# EasyEDA Pro project DRV8701-sch-pcb.epro

# Schematic Schematic1
Board Name: Board1; Create Date: 2025-10-30; Page Name: P1; Project Name: DRV8701-10-30; Schematic Name: Schematic1; Update Date: 2025-11-10; Company: 嘉立创EDA; Page Size: A4; Version: V1.0
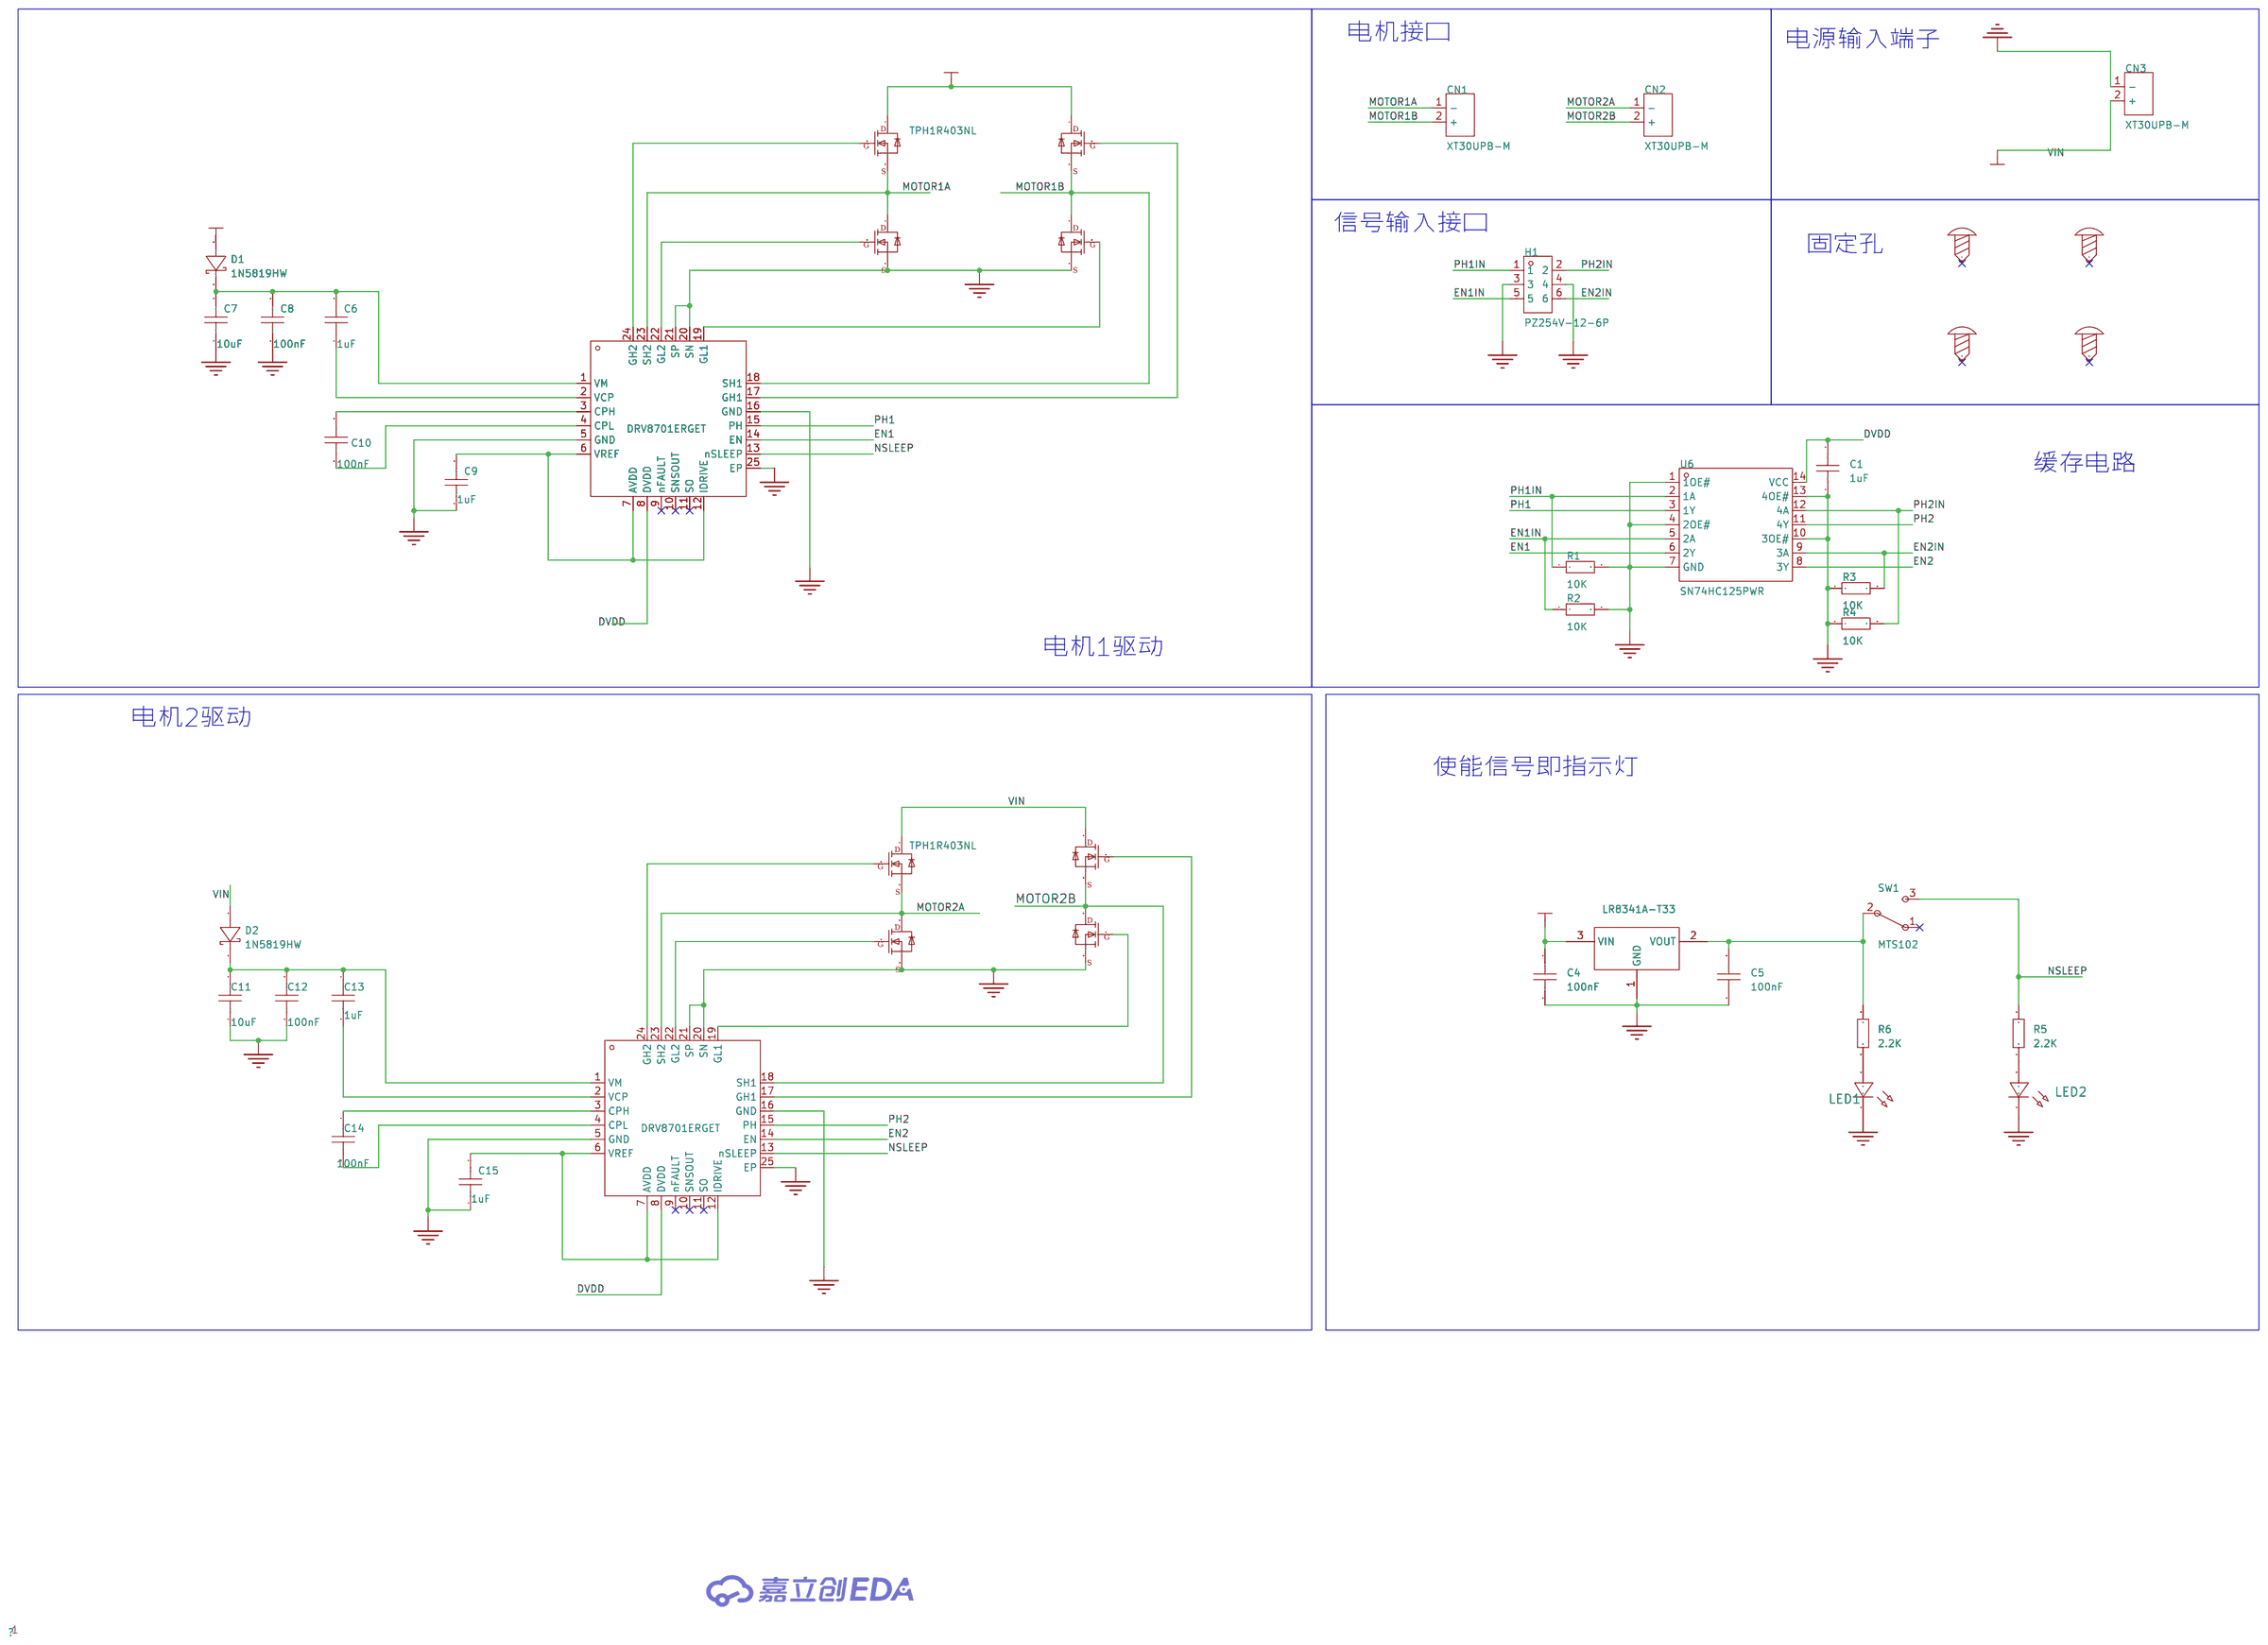
[diagram p0: schematic sheet]

## Parts
C1  1uF  [C0603]
C4  100nF  [C0603]
C5  100nF  [C0603]
C6  1uF  [C0603]
C7  10uF  [C0603]
C8  100nF  [C0603]
C9  1uF  [C0603]
C10  100nF  [C0603]
C11  10uF  [C0603]
C12  100nF  [C0603]
C13  1uF  [C0603]
C14  100nF  [C0603]
C15  1uF  [C0603]
CN1  XT30UPB-M  [CONN-TH_XT30UPB-M]
CN2  XT30UPB-M  [CONN-TH_XT30UPB-M]
CN3  XT30UPB-M  [CONN-TH_XT30UPB-M]
D1  1N5819HW  [SOD-123_L2.7-W1.6-LS3.7-RD-1]
D2  1N5819HW  [SOD-123_L2.7-W1.6-LS3.7-RD-1]
H1  PZ254V-12-6P  [HDR-TH_6P-P2.54-V-M-R2-C3-S2.54]
LED1  -  [LED_0603]
LED2  -  [LED_0603]
Q1  TPH1R403NL  [DFN5x6]
Q3  TPH1R403NL  [DFN5x6]
Q6  TPH1R403NL  [DFN5x6]
Q7  TPH1R403NL  [DFN5x6]
Q12  TPH1R403NL  [DFN5x6]
Q13  TPH1R403NL  [DFN5x6]
Q15  TPH1R403NL  [DFN5x6]
Q16  TPH1R403NL  [DFN5x6]
R1  10K  [R0603]
R2  10K  [R0603]
R3  10K  [R0603]
R4  10K  [R0603]
R5  2.2K  [R0603]
R6  2.2K  [R0603]
SCREW1  -  [M3螺丝]
SCREW2  -  [M3螺丝]
SCREW3  -  [M3螺丝]
SCREW4  -  [M3螺丝]
SW1  MTS102  [MTS102]
U2  DRV8701ERGET  [VQFN-24_L4.0-W4.0-P0.50-BL-EP2.5]
U3  DRV8701ERGET  [VQFN-24_L4.0-W4.0-P0.50-BL-EP2.5]
U6  SN74HC125PWR  [TSSOP-14_L5.0-W4.4-P0.65-LS6.5-BL]
U8  LR8341A-T33  [SOT-23]

## Library data of the parts
C1 C4-C15 = CAP_0603: Supplier Footprint: 0603
CN1-CN3 = XT30UPB-M: Supplier: LCSC; Supplier Part: C428721; Manufacturer: Changzhou Amass Elec; Paste Type: expand
D1 D2 = 1N5819HW: 二极管配置:-;正向压降(Vf):900mV@3A;直流反向耐压(Vr):40V;整流电流:1A;; LCSC Part Name: 电压:40V 电流:1A; Supplier Part: C2905649; Manufacturer: TECH PUBLIC(台舟); Supplier Footprint: SOD-123; JLCPCB Part Class: 扩展库; Datasheet: https://item.szlcsc.com/datasheet/1N5819HW/3175946.html; Supplier: LCSC; Voltage - Forward(Vf@If): 900mV@3A; Voltage - DC Reverse(Vr): 40V; Current - Rectified: 1A; Reverse Leakage Current (Ir): 1mA@40V; Non-Repetitive Peak Forward Surge Current: 9A
H1 = PZ254V-12-6P: 插针结构:2x3P;间距:2.54mm;行距:2.54mm;圆针/方针:方针;安装类型:直插;排数:双排;总PIN位数:6P;额定电流:-;额定电压:-;配合针长度:6mm;塑高:2.5mm;端接针长度:3mm;触头材质:黄铜;触头镀层:-;工作温度范围:-40℃~+105℃;颜色:黑色;; LCSC Part Name: 间距:2.54mm 2x3P 直插 方针; Supplier Part: C492420; Manufacturer: XFCN(兴飞); Supplier Footprint: 插件,P=2.54mm; JLCPCB Part Class: 扩展库; Datasheet: https://atta.szlcsc.com/upload/public/pdf/source/20200309/C492420_BAECB307B001054C09D200388220EAE6.pdf; Supplier: LCSC; Pin Structure: 2x3P; Pitch: 2.54mm; Row Spacing: 2.54mm; Circluar Pins/Square Pins: 方针; Mounting Type: 直插; Number of Rows: 双排; Number of Pins: 6P; Length of Mating Pin: 6mm; Insulation Height: 2.5mm; Length of End Connection Pin: 3mm; Contact Material: 黄铜; Operating Temperature Range: -40℃~+105℃; Color: 黑色
LED1 LED2 = LED_0603-R: Supplier Footprint: 0603
Q1 Q3 Q6 Q7 Q12 Q13 Q15 Q16 = TPH1R403NL
R1-R6 = Res_0603: Supplier Footprint: 0603
SCREW1-SCREW4 = M3螺丝: Supplier Footprint: 插件
SW1 = MTS102: _: 3
U2 U3 = DRV8701ERGET: DRV8701 47V H 桥智能栅极驱动器; LCSC Part Name: 有刷直流电机驱动芯片 5.5V; Supplier Part: C132049; Manufacturer: TI(德州仪器); Supplier Footprint: VQFN-24(4x4); JLCPCB Part Class: 扩展库; Datasheet: https://www.ti.com/cn/lit/gpn/drv8701; Supplier: LCSC
U6 = SN74HC125PWR: 输入类型:-;工作电压:2V~6V;元件数:4;每个元件位数:1;灌电流(IOL):7.8mA;拉电流(IOH):7.8mA;; LCSC Part Name: 三态输出，四路总线缓冲门; Supplier Part: C132994; Manufacturer: TI(德州仪器); Supplier Footprint: TSSOP-14; JLCPCB Part Class: 扩展库; Datasheet: https://www.ti.com/cn/lit/gpn/sn74hc125; Supplier: LCSC; output type: 三态; Voltage - Supply: 2V~6V; Number of Elements: 4; Number of Bits per Element: 1; Current - Output Low(IOL): 7.8mA; Current - Output High(IOH): 7.8mA; Logic Family: 74HC; Operating Temperature: -40℃~+85℃
U8 = LR8341A-T33: Revision: V1.0

## Nets
DVDD: C1.2 U2.8(DVDD) U3.8(DVDD) U6.14(VCC)
GND: C1.1 C4.1 C5.1 C7.1 C8.1 C9.1 C11.1 C12.1 C15.1 CN3.1(-) H1.3 H1.4 LED1.1(C) LED2.1(C) Q3.3(S) Q7.3(S) Q12.3(S) Q16.3(S) R1.2 R2.2 R3.1 R4.1 U2.5(GND) U2.16(GND) U2.20(SN) U2.21(SP) U2.25(EP) U3.5(GND) U3.16(GND) U3.20(SN) U3.21(SP) U3.25(EP) U6.1(1OE#) U6.4(2OE#) U6.7(GND) U6.10(3OE#) U6.13(4OE#) U8.1(GND)
VIN: C4.2 CN3.2(+) D1.2(A) D2.2(A) Q1.1(D) Q6.1(D) Q13.1(D) Q15.1(D) U8.3(VIN)
EN1: U2.14(EN) U6.6(2Y)
EN1IN: H1.5 R2.1 U6.5(2A)
EN2: U3.14(EN) U6.8(3Y)
EN2IN: H1.6 R3.2 U6.9(3A)
MOTOR1A: CN1.1(-) Q1.3(S) Q3.1(D) U2.23(SH2)
MOTOR1B: CN1.2(+) Q12.1(D) Q13.3(S) U2.18(SH1)
MOTOR2A: CN2.1(-) Q6.3(S) Q7.1(D) U3.23(SH2)
MOTOR2B: CN2.2(+) Q15.3(S) Q16.1(D) U3.18(SH1)
NSLEEP: R5.2 SW1.3(ON) U2.13(nSLEEP) U3.13(nSLEEP)
PH1: U2.15(PH) U6.3(1Y)
PH1IN: H1.1 R1.1 U6.2(1A)
PH2: U3.15(PH) U6.11(4Y)
PH2IN: H1.2 R4.2 U6.12(4A)
$1N1170: C9.2 U2.6(VREF) U2.7(AVDD) U2.12(IDRIVE)
$1N1184: C10.2 U2.3(CPH)
$1N1190: C10.1 U2.4(CPL)
$1N1364: C6.2 C7.2 C8.2 D1.1(K) U2.1(VM)
$1N1383: C6.1 U2.2(VCP)
$1N2084: Q1.2(G) U2.24(GH2)
$1N2125: Q12.2(G) U2.19(GL1)
$1N2170: Q3.2(G) U2.22(GL2)
$1N2669: C15.2 U3.6(VREF) U3.7(AVDD) U3.12(IDRIVE)
$1N2677: C14.1 U3.3(CPH)
$1N2681: C14.2 U3.4(CPL)
$1N2741: Q6.2(G) U3.24(GH2)
$1N2748: Q16.2(G) U3.19(GL1)
$1N2751: Q7.2(G) U3.22(GL2)
$1N4000: C5.2 R6.2 SW1.2(OFF) U8.2(VOUT)
$1N4233: LED1.2(A) R6.1
$1N4235: LED2.2(A) R5.1
$1N8347: Q15.2(G) U3.17(GH1)
$1N8399: Q13.2(G) U2.17(GH1)
$1N8457: C13.2 U3.2(VCP)
$1N8464: C11.2 C12.2 C13.1 D2.1(K) U3.1(VM)

Not connected (* = marked no-connect by the designer): SCREW1 1*; SCREW2 1*; SCREW3 1*; SCREW4 1*; SW1 1(ON)*; U2 9(nFAULT)* 10(SNSOUT)* 11(SO)*; U3 9(nFAULT)* 10(SNSOUT)* 11(SO)*

## Notes on the sheet
- 电机接口
- 电源输入端子
- 信号输入接口
- 固定孔
- 缓存电路
- 电机1驱动
- 电机2驱动
- 使能信号即指示灯

# Board PCB1
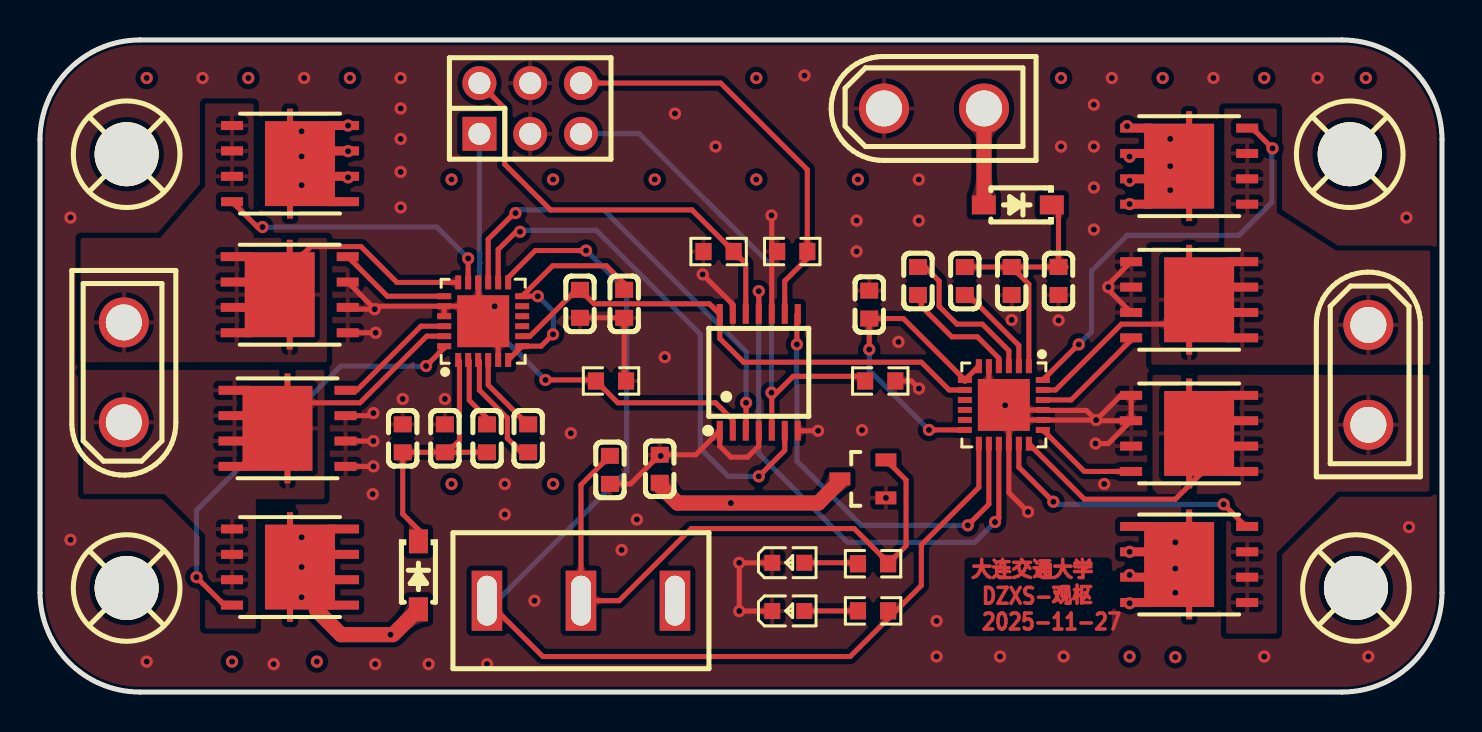
[diagram p1: board, top side]
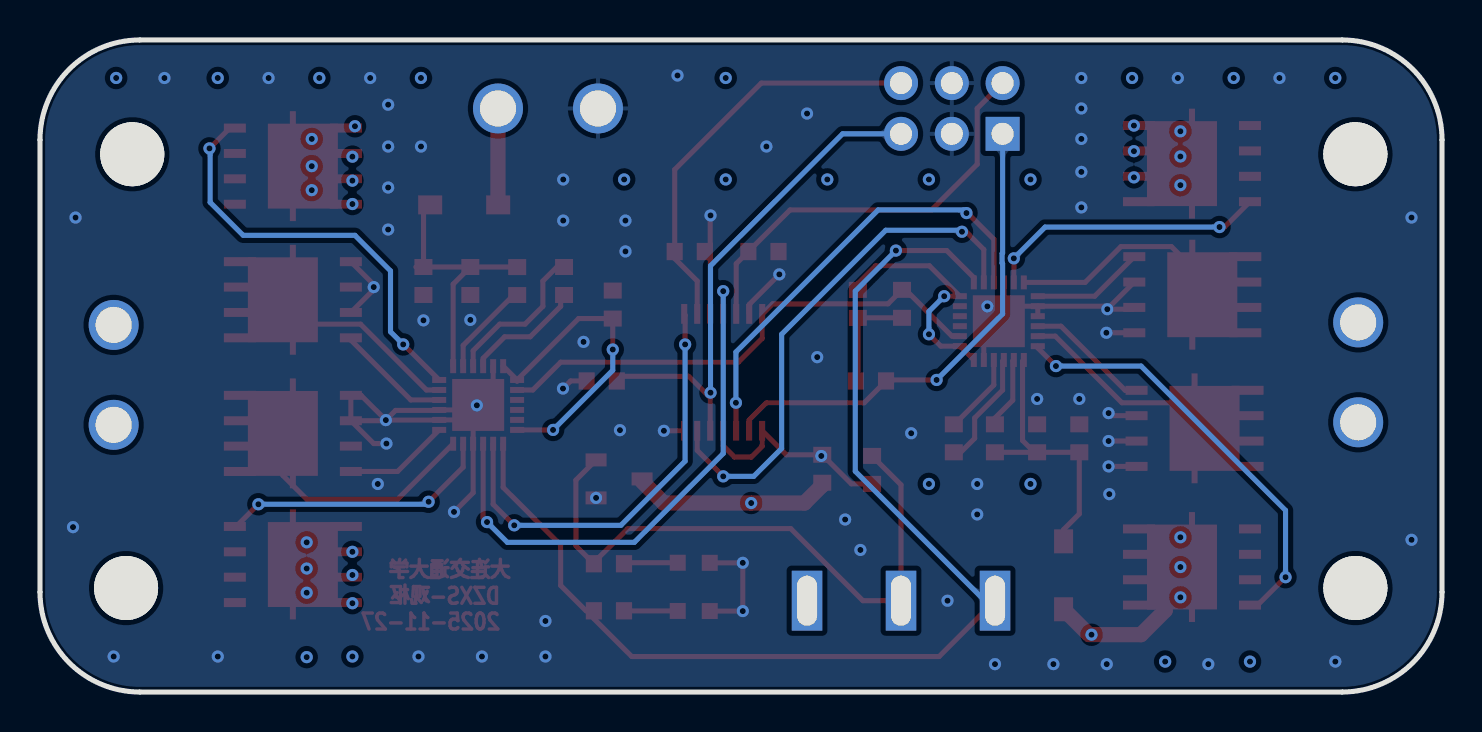
[diagram p2: board, bottom side, seen from below]

Outline 70.1 x 32.64 mm; copper layers: Top Layer, PWR, GND, Bottom Layer. Coordinates in mm from the lower left corner of the outline.
Outline path: 0,27.64 0,5 arc(1.46,1.46) 5,0 65.1,0 arc(68.64,1.46) 70.1,5 70.1,27.64 arc(68.64,31.17) 65.1,32.64 5,32.64 arc(1.46,31.17) 0,27.64
Stack: Top Layer 0.035mm 外层铜厚1oz / Dielectric1 0.2104mm 7628 RC49% 8.6mil / PWR 0.0152mm 内层铜厚 / Dielectric2 1.065mm 1.1mm H/HOZ Copper / GND 0.0152mm 内层铜厚 / Dielectric3 0.2104mm 7628 RC49% 8.6mil / Bottom Layer 0.035mm 外层铜厚1oz

## Design rules (mm)
template: 自定义配置
spacing copperThickness1oz (default): track to track 0.102, other pairs 0.152 to 0.3
spacing copperThickness2oz: track to track 0.203, other pairs 0.152 to 0.3
track width copperThickness1oz (default): min 0.127, default 0.254, max 2.54
track width copperThickness2oz: min 0.127, default 0.254, max 2.54
differential pair differentialPair (default): width min 0.127, default 0.254, max 2.54; gap min 0.152, default 0.152
via viaSize (default): diameter min 0.5, default 0.61, max 10; hole min 0.3, default 0.305, max 6.3
net GND uses 全铺
net VIN uses 全铺

## Placement (name value [footprint] x y rotation side)
C1  1uF  [C0603]  27 19.43 90 top
C4  100nF  [C0603]  30.99 11.18 270 top
C5  100nF  [C0603]  28.5 11.12 90 top
C6  1uF  [C0603]  22.35 12.7 270 top
C7  10uF  [C0603]  18.14 12.7 270 top
C8  100nF  [C0603]  20.25 12.7 270 top
C9  1uF  [C0603]  29.21 19.43 90 top
C10  100nF  [C0603]  24.41 12.7 270 top
C11  10uF  [C0603]  50.93 20.57 90 top
C12  100nF  [C0603]  48.59 20.57 90 top
C13  1uF  [C0603]  46.24 20.57 270 top
C14  100nF  [C0603]  43.9 20.57 270 top
C15  1uF  [C0603]  41.46 19.39 270 top
CN1  XT30UPB-M  [CONN-TH_XT30UPB-M]  4.19 16 90 top
CN2  XT30UPB-M  [CONN-TH_XT30UPB-M]  66.42 15.88 270 top
CN3  XT30UPB-M  [CONN-TH_XT30UPB-M]  44.7 29.21 0 top
D1  1N5819HW  [SOD-123_L2.7-W1.6-LS3.7-RD-1]  18.92 5.84 270 top
D2  1N5819HW  [SOD-123_L2.7-W1.6-LS3.7-RD-1]  48.9 24.38 180 top
H1  PZ254V-12-6P  [HDR-TH_6P-P2.54-V-M-R2-C3-S2.54]  24.51 29.21 0 top
LED1  -  [LED_0603]  37.47 6.48 0 top
LED2  -  [LED_0603]  37.47 4.06 0 top
Q1  TPH1R403NL  [DFN5x6]  12.5 6.26 270 top
Q3  TPH1R403NL  [DFN5x6]  12.38 13.2 90 top
Q6  TPH1R403NL  [DFN5x6]  57.46 26.32 90 top
Q7  TPH1R403NL  [DFN5x6]  57.46 19.63 270 top
Q12  TPH1R403NL  [DFN5x6]  12.49 19.89 90 top
Q13  TPH1R403NL  [DFN5x6]  12.5 26.45 270 top
Q15  TPH1R403NL  [DFN5x6]  57.46 6.38 90 top
Q16  TPH1R403NL  [DFN5x6]  57.46 12.95 270 top
R1  10K  [R0603]  28.55 15.57 0 top
R2  10K  [R0603]  42.01 15.57 0 top
R3  10K  [R0603]  37.61 22.05 0 top
R4  10K  [R0603]  33.93 22.05 0 top
R5  2.2K  [R0603]  41.66 4.06 0 top
R6  2.2K  [R0603]  41.66 6.42 0 top
SCREW1  -  [M3螺丝]  4.33 5.21 0 top
SCREW2  -  [M3螺丝]  4.33 26.92 0 top
SCREW3  -  [M3螺丝]  65.49 26.92 0 top
SCREW4  -  [M3螺丝]  65.8 5.21 0 top
SW1  ON  [MTS102]  26.92 4.57 180 top
U2  DRV8701ERGET  [VQFN-24_L4.0-W4.0-P0.50-BL-EP2.5]  22.16 18.56 0 top
U3  DRV8701ERGET  [VQFN-24_L4.0-W4.0-P0.50-BL-EP2.5]  48.2 14.37 180 top
U6  SN74HC125PWR  [TSSOP-14_L5.0-W4.4-P0.65-LS6.5-BL]  35.94 16 0 top
U8  LR8341A-T33  [SOT-23]  41.15 10.67 180 top

## Footprints (pads in the part's own frame, mm; a bottom-side part is the same pattern mirrored in y, then rotated)
C0603
  rect 0.8x0.9 smd: 1(-0.7,0) 2(0.7,0)
CONN-TH_XT30UPB-M
  round 2.5 hole 1.8: 1(-2.5,0) 2(2.5,0)
DFN5x6
  rect 0.45x1.6 smd: 1(-1.905,2.65) 1(-0.635,2.65) 1(0.635,2.65) 1(1.905,2.65)
  rect 4.25x3.5 smd: 1(0,0.5)
  rect 5.5x0.3 smd: 1(0,0)
  rect 0.45x1.1 smd: 2(1.905,-2.9) 3(-1.905,-2.9) 3(-0.635,-2.9) 3(0.635,-2.9)
HDR-TH_6P-P2.54-V-M-R2-C3-S2.54
  rect 1.7x1.7 hole 1.1: 1(-2.54,-1.27)
  round 1.7 hole 1.1: 2(-2.54,1.27) 3(0,-1.27) 4(0,1.27) 5(2.54,-1.27) 6(2.54,1.27)
LED_0603
  rect 0.8x0.8 smd: 1(-0.851,-0.01) 2(0.75,-0.005)
M3螺丝
  round 3.2 hole 3.2: 1(0,0)
MTS102
  rect 1.524x2.999 hole 1.001x2.499: 1(-4.826,0) 2(-0.127,0) 3(4.574,0)
R0603
  rect 0.806x0.864 smd: 1(-0.753,0) 2(0.753,0)
SOD-123_L2.7-W1.6-LS3.7-RD-1
  rect 1.2x0.95 smd: 1(-1.7,0) 2(1.7,0)
SOT-23
  rect 1.05x0.65 smd: 1(-1.15,0.95) 2(-1.15,-0.95) 3(1.15,0)
TSSOP-14_L5.0-W4.4-P0.65-LS6.5-BL
  rect 0.305x0.991 smd: 1(-1.95,-2.925) 2(-1.3,-2.925) 3(-0.65,-2.925) 4(0,-2.925) 5(0.65,-2.925) 6(1.3,-2.925) 7(1.95,-2.925) 8(1.95,2.925) 9(1.3,2.925) 10(0.65,2.925) 11(0,2.925) 12(-0.65,2.925) 13(-1.3,2.925) 14(-1.95,2.925)
VQFN-24_L4.0-W4.0-P0.50-BL-EP2.5
  rect 0.3x0.7 smd: 1(-1.25,-1.942) 2(-0.75,-1.942) 3(-0.25,-1.942) 4(0.25,-1.942) 5(0.75,-1.942) 6(1.25,-1.942) 13(1.25,1.942) 14(0.75,1.942) 15(0.25,1.942) 16(-0.25,1.942) 17(-0.75,1.942) 18(-1.25,1.942)
  rect 0.7x0.3 smd: 7(1.948,-1.25) 8(1.948,-0.75) 9(1.948,-0.25) 10(1.948,0.25) 11(1.948,0.75) 12(1.948,1.25) 19(-1.948,1.25) 20(-1.948,0.75) 21(-1.948,0.25) 22(-1.948,-0.25) 23(-1.948,-0.75) 24(-1.948,-1.25)
  rect 2.6x2.6 smd: 25(0.001,-0.001)

## Nets
As in the schematic.

Pads without a net: SCREW1 1; SCREW2 1; SCREW3 1; SCREW4 1; SW1 1; U2 9 10 11; U3 9 10 11

## Via types
v1: diameter 0.61, hole 0.305, Top Layer to Bottom Layer, 137 vias

## Routing (per net, layer and track width the routed paths; a pad name or vN(x,y) marks a point on that pad's centre or on a via; arc(x,y) is an arc through that point)
DVDD: length 25.9
  Top Layer w0.254: 33.99,18.91 33.47,19.43 27.7,19.43 C1.2 26.82,20.13 24.5,17.81 U2.8 ; 33.99,18.91 33.99,17.7 35.18,16.51 44.07,16.51 45.46,15.12 U3.8 ; 33.99,18.91 33.99,18.93
GND: length 78.2
  Top Layer w0.254: 34.64,18.91 34.64,19.4 v1(33.14,20.91) ; v1(16.74,19.16) 15.48,19.16 15.39,19.25 ; v1(16.74,19.16) 16.74,19.17 15.39,20.52 ; v1(16.74,19.16) 16.89,19.31 U2.20 ; 34.96,4.05 v1(34.96,6.47) LED1.1 ; v1(16.67,13.96) 16.55,13.83 Q3.3 ; v1(52.81,13.61) 52.33,14.1 50.14,14.1 U3.21 48.49,14.12 48.42,14.14 ; v1(52.81,13.61) 54.05,14.85 Q16.3 Q16.3 ; v1(52.81,13.61) 50.15,13.61 U3.20 48.95,13.62 48.45,14.12 ; v1(52.81,13.61) 52.84,13.58 Q16.3 ; Q7.3 53.42,20.4 v1(53.42,20.27) 53.42,20.14 Q7.3 ; U6.4 35.94,12.32 35.38,11.76 34.54,11.76 33.99,12.31 U6.1 32.79,11.88 C4.1 29.53,10.42 C5.1 ; U2.25 22.91,17.81 U2.5 ; U6.7 v1(38.91,13.08) ; 21.91,19.31 22.72,19.31 v1(22.73,19.3) ; 21.91,19.31 U2.20 ; 21.91,19.31 21.91,18.81 ; 21.91,19.31 U2.16 ; Q16.3 53.42,12.44 v1(52.78,12.44) ; v1(49.4,9.02) 48.45,9.97 U3.16 48.45,14.12 ; U3.5 47.45,15.29 47.39,15.24 ; 36.59,18.91 36.59,23.84 v1(36.58,23.86) ; v1(16.67,12.56) Q3.3 ; v1(16.78,17.98) 15.39,17.98 ; 48.42,14.14 U3.25 ; 48.42,14.14 48.45,14.12 ; 27,18.73 29.21,18.73 29.21,15.67 R1.2 ; U2.20 U2.21 ; R2.2 43.57,15.57 v1(43.95,15.19) ; v1(16.67,11.29) Q3.3 ; v1(34.96,4.05) 36.61,4.05
  vias: v1(1.52,23.75) v1(1.52,7.62) v1(5.33,1.52) v1(8.13,30.73) v1(11.68,1.4) v1(13.21,30.73) v1(16.64,9.91) v1(16.76,1.4) v1(18.03,30.73) v1(18.03,29.21) v1(18.03,27.69) v1(18.03,26.03) v1(18.03,24.26) v1(18.14,14.67) v1(19.43,1.4) v1(20.25,14.67) v1(22.35,1.4) v1(23.24,10.41) v1(23.24,8.89) v1(24.73,4.57) v1(26.54,12.95) v1(29.08,7.11) v1(29.84,8.64) v1(31.04,11.82) v1(31.24,16.76) v1(31.75,28.96) v1(33.78,27.31) v1(38.23,30.86) v1(40.83,23.6) v1(40.83,22.05) v1(41.1,13.11) v1(42.3,9.72) v1(42.93,17.53) v1(43.94,25.65) v1(43.94,23.6) v1(44.83,3.56) v1(44.83,1.78) v1(48.01,1.78) v1(48.26,14.35) v1(48.59,18.63) v1(50.93,18.6) v1(51.05,27.31) v1(51.18,1.78) v1(52.7,29.4) v1(52.7,27.31) v1(52.7,25.25) v1(52.7,23.15) v1(53.21,10.41) v1(53.59,30.73) v1(58.67,30.73) v1(61.21,1.78) v1(63.88,30.73) v1(66.42,1.78) v1(68.33,23.75) v1(68.45,8.25)
VIN: length 24.6
  Top Layer w0.254: v1(56.51,27.69) v1(56.51,26.32)
  Top Layer w0.762: 40,10.54 38.92,9.46 v1(34.54,9.46) 31.88,9.46 30.99,10.35 C4.2 ; 17.65,2.87 D1.2 ; Q1.1 13.84,5.42 13.84,4.08 15.05,2.87 v1(17.53,2.87) ; CN3.2 47.2,24.39 D2.2
  vias: v1(5.34,30.74) v1(9.6,1.52) v1(10.42,30.74) v1(13.08,28.07) v1(13.08,26.81) v1(13.08,25.37) v1(13.08,7.75) v1(13.08,6.26) v1(13.08,4.74) v1(13.84,1.52) v1(15.4,28.35) v1(15.4,27.07) v1(15.4,25.76) v1(15.5,30.74) v1(20.58,25.66) v1(20.58,10.42) v1(25.66,25.66) v1(25.66,10.42) v1(30.74,25.66) v1(35.82,30.74) v1(35.82,25.66) v1(40.9,25.66) v1(51.06,30.74) v1(54.36,28.32) v1(54.48,26.8) v1(54.48,25.6) v1(54.48,24.43) v1(54.48,7.02) v1(54.48,5.86) v1(54.48,4.45) v1(54.48,1.78) v1(56.14,30.74) v1(56.51,25.12) v1(56.77,7.49) v1(56.77,6.18) v1(56.77,4.97) v1(56.77,1.75) v1(61.22,30.74) v1(66.3,30.74)
EN1: length 26.3
  Top Layer w0.254: 37.24,13.06 37.24,12.09 v1(35.94,10.8) ; v1(24,23.04) 23.8,23.04 22.91,22.15 U2.14
  Bottom Layer w0.254: v1(35.94,10.8) 34.42,10.8 33.02,12.19 33.02,17.91 27.81,23.11 24.08,23.11 v1(24,23.04)
EN1IN: length 25.8
  Top Layer w0.254: 36.59,13.06 36.59,14.73 ; 36.59,14.73 36.59,14.97 v1(36.58,14.99) ; 36.59,14.73 37.66,15.8 41.03,15.8 R2.1
  Bottom Layer w0.254: v1(36.58,14.99) 36.58,21.34 29.97,27.94 H1.5
EN2: length 21.8
  Top Layer w0.254: U3.14 47.45,9.4 v1(46.39,8.34) ; v1(37.85,17.4) 37.85,18.87 37.89,18.91
  Bottom Layer w0.254: v1(37.85,17.4) 37.85,11.56 41.06,8.34 v1(46.39,8.34)
EN2IN: length 20.8
  Top Layer w0.254: 37.24,18.91 37.24,20.57 38.37,21.7 R3.2 38.37,26.15 34.04,30.48 H1.6
MOTOR1A: length 10.2
  Top Layer w0.254: Q3.1 13.15,14.48 16,14.48 19.34,17.81 U2.23
MOTOR1B: length 11
  Top Layer w0.254: Q12.1 12.49,21.25 13.53,22.3 16.05,22.3 17.84,20.5 U2.18
MOTOR2A: length 9.7
  Top Layer w0.254: Q7.1 56.74,18.42 54.08,18.42 50.78,15.12 U3.23
MOTOR2B: length 12.3
  Top Layer w0.254: Q16.1 57.96,10.84 56.77,9.65 52.22,9.65 U3.18
NSLEEP: length 59.1
  Top Layer w0.254: v1(27.31,22.1) 24.76,22.1 23.41,20.74 U2.13 ; SW1.3 25.14,1.78 ; U3.13 46.95,10.24 44.07,7.37 44.07,5.33 42.8,4.06 R5.2 42.41,3.67 40.51,1.78 25.15,1.78
  Bottom Layer w0.254: v1(27.31,22.1) 29.34,20.07 29.34,11.05 22.86,4.57 SW1.3
PH1: length 22.6
  Top Layer w0.254: v1(35.31,14.48) 35.31,13.08 35.29,13.06 ; v1(23.78,23.97) 23.72,23.97 22.41,22.66 U2.15
  Bottom Layer w0.254: v1(23.78,23.97) 23.93,24.13 28.19,24.13 35.31,17.02 v1(35.31,14.48)
PH1IN: length 24.5
  Top Layer w0.254: v1(25.27,15.62) 27.75,15.62 27.8,15.57 28.89,14.48 33.78,14.48 34.64,13.62 34.64,13.06
  Bottom Layer w0.254: v1(25.27,15.62) 21.97,18.92 21.97,21.44 21.99,21.46 21.99,21.95 21.97,21.97 H1.1
PH2: length 27.4
  Top Layer w0.254: U3.15 47.95,8.7 v1(47.75,8.51) ; v1(35.94,20.07) 35.94,18.91
  Bottom Layer w0.254: v1(35.94,20.07) 35.94,11.94 40.39,7.49 46.74,7.49 v1(47.75,8.51)
PH2IN: length 21.2
  Top Layer w0.254: 35.29,18.91 35.29,21.44 R4.2 32.6,24.13 25.53,24.13 23.24,26.42 23.24,29.21 H1.2
$1N1170: length 12.2
  Top Layer w0.254: v1(25.65,17.91) 25.06,17.31 U2.7 24.1,17.31 U2.6 ; C9.2 29.21,20.45 28.32,21.34 25.63,21.34 U2.12 v1(24.89,19.81)
  Bottom Layer w0.254: v1(24.89,19.81) 25.65,19.05 v1(25.65,17.91)
$1N1184: length 5.9
  Top Layer w0.254: U2.3 21.97,16.56 21.97,15.11 23.37,13.72 23.37,12.7 24.07,12 C10.2
$1N1190: length 4.1
  Top Layer w0.254: C10.1 24.38,13.4 22.41,15.37 U2.4
$1N1364: length 13.7
  Top Layer w0.254: D1.1 18.92,8.13 18.14,8.91 C7.2 C8.2 20.38,12 ; 20.38,12 22.2,12 ; 20.38,12 20.97,12.59 20.97,16.56 U2.1
$1N1383: length 3.6
  Top Layer w0.254: C6.1 22.35,13.71 21.46,14.61 21.46,16.57 U2.2
$1N2084: length 21.5
  Top Layer w0.254: U2.24 20.21,17.23 v1(19.3,16.32) ; v1(7.82,5.75) 9.22,4.35 Q1.2
  Bottom Layer w0.254: v1(19.3,16.32) 15.05,16.32 7.82,9.09 v1(7.82,5.75)
$1N2125: length 5.6
  Top Layer w0.254: U2.19 17.37,19.81 15.39,21.79
$1N2170: length 6.3
  Top Layer w0.254: Q3.2 15.84,15.1 19.05,18.31 U2.22
$1N2669: length 15.7
  Top Layer w0.254: U3.7 46.25,15.55 ; U3.7 43.17,18.7 41.46,18.7 v1(41.46,17.14) ; U3.7 46.94,16.31 U3.6 ; U3.12 v1(44.45,13.12)
  Bottom Layer w0.254: v1(44.45,13.12) 41.46,16.11 v1(41.46,17.14)
$1N2677: length 7.8
  Top Layer w0.254: U3.3 48.45,17.09 47.12,18.42 45.85,18.42 44.96,19.3 44.96,20.57 44.26,21.27 C14.1
$1N2681: length 6
  Top Layer w0.254: C14.2 44.07,19.7 44.07,19.3 45.59,17.78 46.87,17.78 47.95,16.71 U3.4
$1N2741: length 21.3
  Top Layer w0.254: v1(51.94,17.4) 51.92,17.4 U3.24 ; Q6.2 60.61,28.23 v1(61.63,27.21)
  Bottom Layer w0.254: v1(61.63,27.21) 61.59,27.18 61.59,24.51 59.94,22.86 54.36,22.86 52.58,21.08 52.58,18.03 v1(51.94,17.4)
$1N2748: length 5.3
  Top Layer w0.254: U3.19 52.22,11.04 Q16.2
$1N2751: length 5.8
  Top Layer w0.254: Q7.2 54.56,17.62 51.56,14.62 U3.22
$1N4000: length 31.5
  Top Layer w0.254: C5.2 27.05,10.37 SW1.2 28.96,4.57 32.56,8.18 40.71,8.18 42.41,6.49 R6.2 43.31,7.32 43.31,10.61 U8.2
$1N4233: length 2.7
  Top Layer w0.254: R6.1 40.85,6.47 LED1.2
$1N4235: length 2.7
  Top Layer w0.254: R5.1 40.9,4.06 LED2.2
$1N8347: length 13.8
  Top Layer w0.254: v1(50.67,9.53) 48.95,11.25 U3.17 ; v1(59.18,9.4) 60.29,8.29 Q15.2
  Bottom Layer w0.254: v1(50.67,9.53) 50.8,9.4 v1(59.18,9.4)
$1N8399: length 14.2
  Top Layer w0.254: Q13.2 10.87,23.27 v1(11.13,23.27) ; v1(21.41,21.71) U2.17
  Bottom Layer w0.254: v1(21.41,21.71) 19.84,23.27 v1(11.13,23.27)
$1N8457: length 4.8
  Top Layer w0.254: C13.2 46.42,19.87 48.95,17.35 U3.2
$1N8464: length 13.6
  Top Layer w0.254: C12.2 50.93,21.27 50.93,24.05 D2.1 ; C12.2 46.25,21.27 C13.1 ; C12.2 49.45,20.41 U3.1 ; C11.2 51.31,21.27

## Copper pours and planes (outline as drawn; the poured copper is in the pictures)
GND on Top Layer: -1.4,34.54 71.37,34.54 71.37,-3.43 -1.4,-3.43
GND on Bottom Layer: -2.03,35.81 70.87,35.81 70.87,-3.43 -2.03,-3.43
GND on GND: 0.26,32.38 69.85,32.38 69.85,0.26 0.26,0.26
VIN on PWR: 0.26,32.38 69.85,32.38 69.85,0.26 0.26,0.26
MOTOR1A on Top Layer: 2.16,10.03 2.16,9.91 6.22,9.91 8.25,7.87 8.25,3.18 10.8,3.18 10.8,9.65 14.22,9.65 14.22,16.13 2.16,16.13 2.03,16 2.16,15.88
MOTOR1B on Top Layer: 14.35,22.73 14.35,16.51 2.03,16.51 2.03,22.73
MOTOR1B on Top Layer: 8.25,29.46 8.25,25.32 5.72,22.39 10.68,22.39 10.68,29.45 10.67,29.46
MOTOR2A on Top Layer: 59.22,29.21 61.85,29.21 61.85,23.99 64.81,22.1 69.52,22.1 69.52,16.38 55.56,16.38 55.56,22.26 59.22,22.26
MOTOR2B on Top Layer: 55.63,10.16 55.88,9.91 59.31,9.91 59.31,2.92 61.85,2.92 61.85,6.98 64.9,10.03 69.47,10.03 69.47,15.88 55.63,15.88

Small or netless copper shapes (teardrops, artwork), in the pictures only: 191 on Top Layer, 23 on Bottom Layer

## Text on the board
Top Layer: 大连交通大学 / DZXS-观枢 / 2025-11-27
